# Altium schematic sheet IMX291.SchDoc
size C
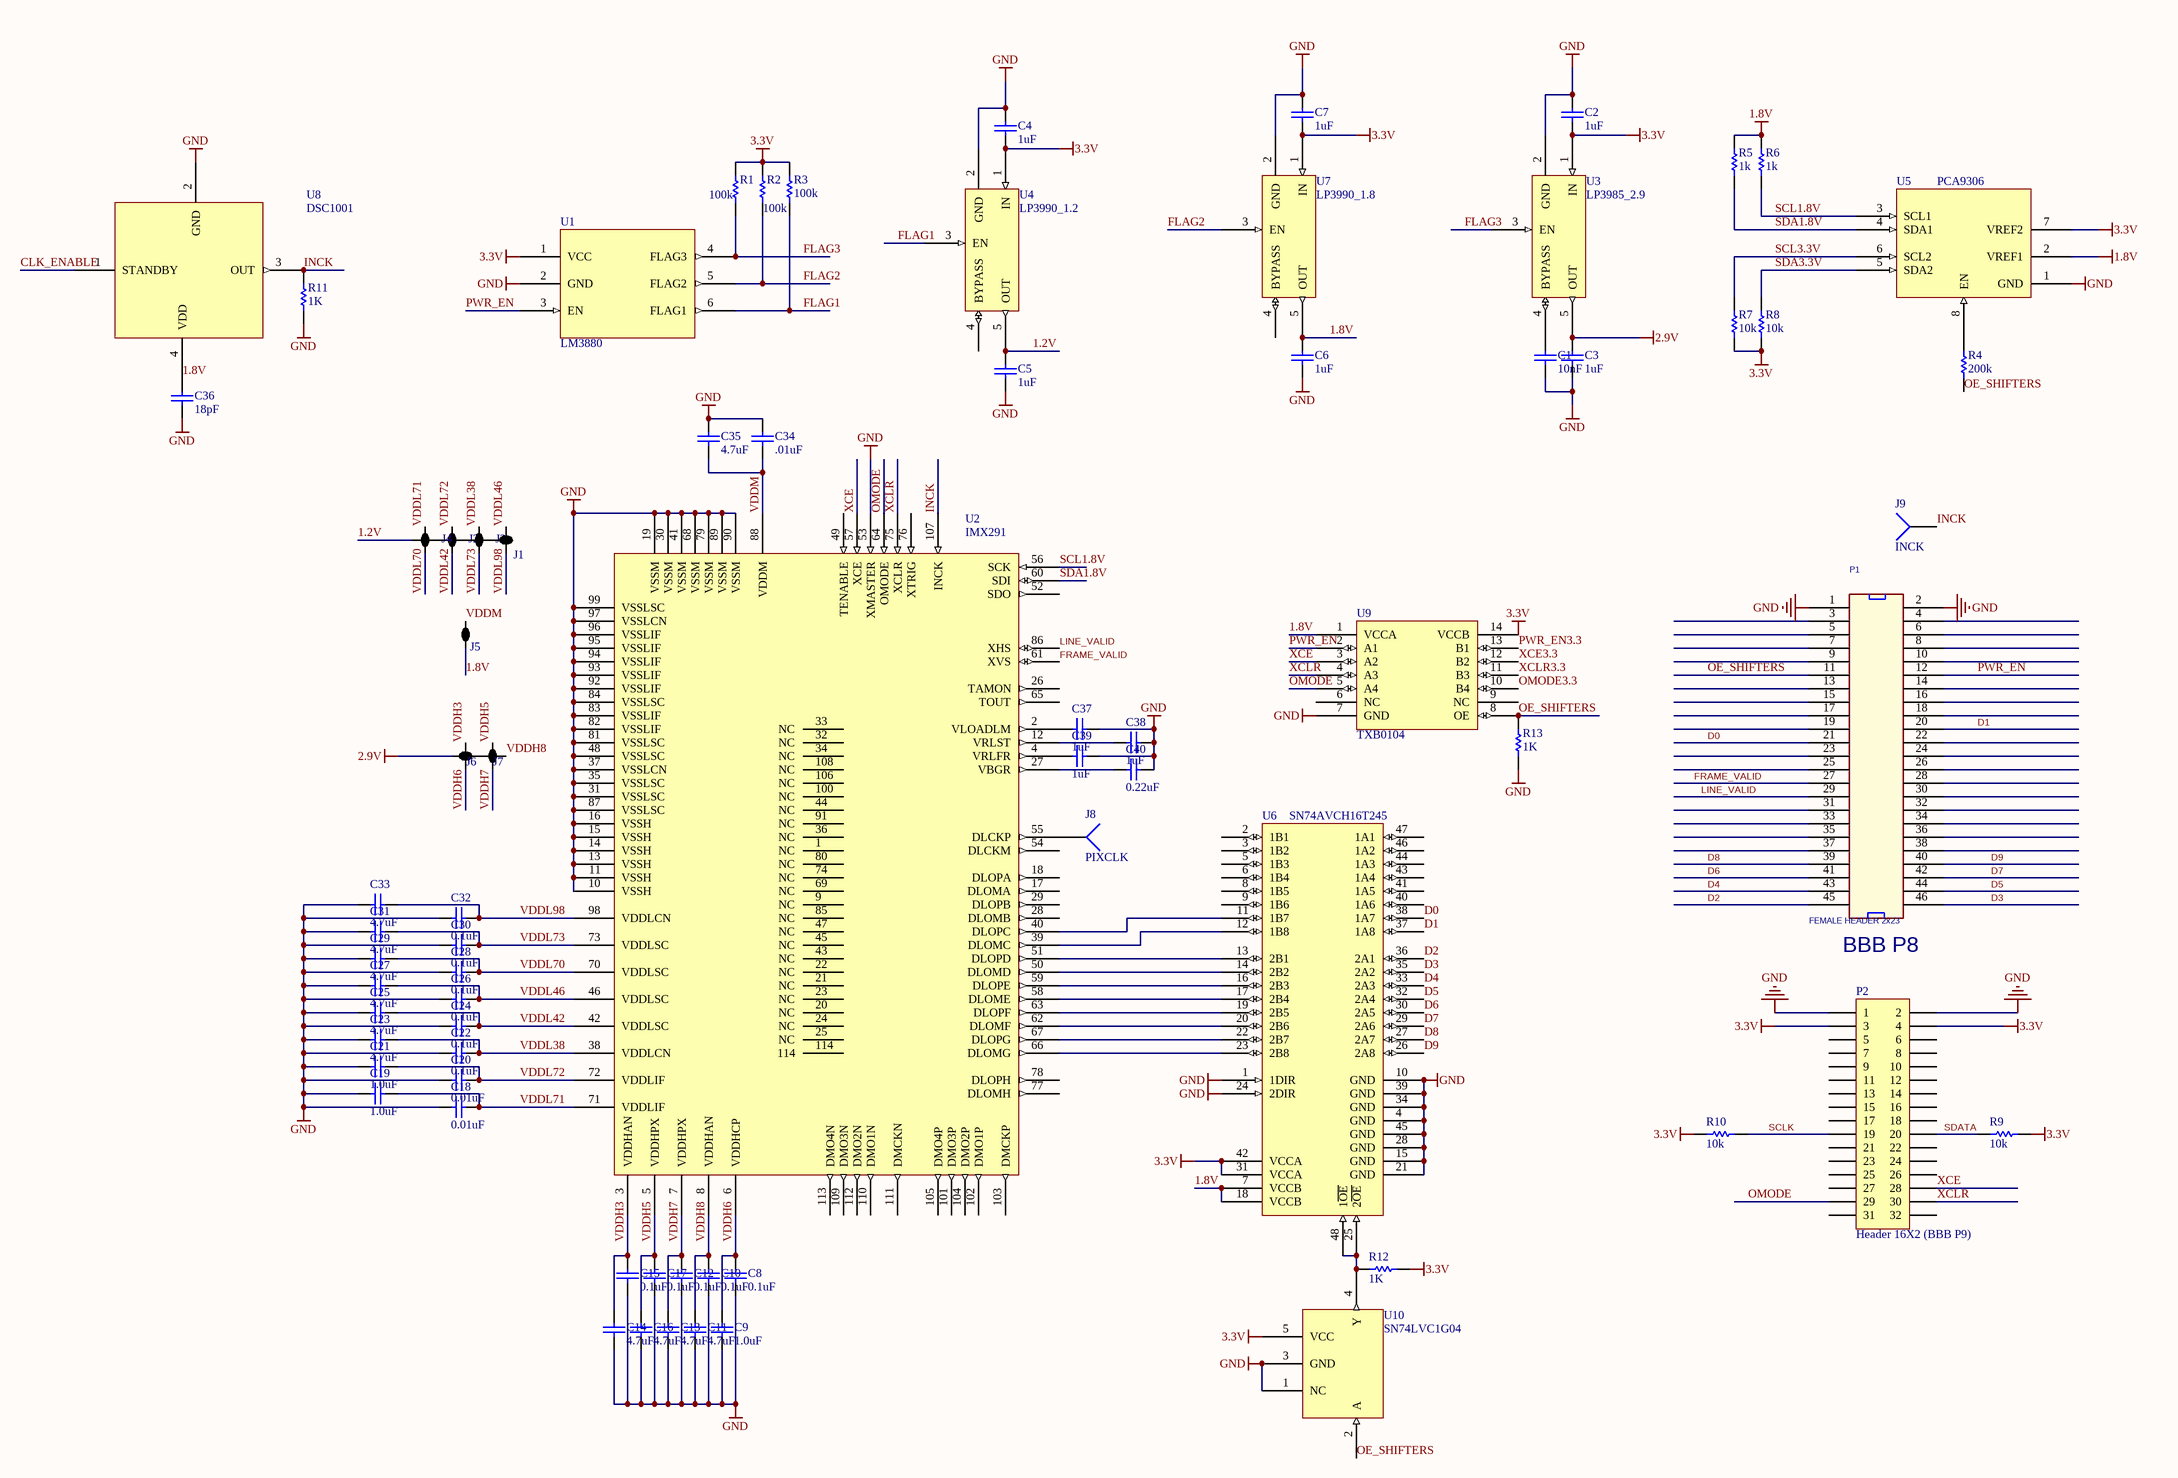
[diagram p0: IMX291.SchDoc]

## Parts
C1  10nF  [0603]
C2  1uF  [0603]
C3  1uF  [0603]
C4  1uF  [0603]
C5  1uF  [0603]
C6  1uF  [0603]
C7  1uF  [0603]
C8  0.1uF  [0603]
C9  1.0uF  [0603]
C10  0.1uF  [0603]
C11  4.7uF  [0603]
C12  0.1uF  [0603]
C13  4.7uF  [0603]
C14  4.7uF  [0603]
C15  0.1uF  [0603]
C16  4.7uF  [0603]
C17  0.1uF  [0603]
C18  0.01uF  [0603]
C19  1.0uF  [0603]
C20  0.01uF  [0603]
C21  1.0uF  [0603]
C22  0.1uF  [0603]
C23  4.7uF  [0603]
C24  0.1uF  [0603]
C25  4.7uF  [0603]
C26  0.1uF  [0603]
C27  4.7uF  [0603]
C28  0.1uF  [0603]
C29  4.7uF  [0603]
C30  0.1uF  [0603]
C31  4.7uF  [0603]
C32  0.1uF  [0603]
C33  4.7uF  [0603]
C34  .01uF  [0603]
C35  4.7uF  [0603]
C36  18pF  [0603]
C37  1uF  [0603]
C38  1uF  [0603]
C39  1uF  [0603]
C40  0.22uF  [0603]
J1  3 way net tie junction T shape  [3wayT_LP]  (value not drawn)  (net tie, no BOM)
J2  4 way net tie junction  [4way_LP]  (value not drawn)  (net tie, no BOM)
J3  4 way net tie junction  [4way_LP]  (value not drawn)  (net tie, no BOM)
J4  4 way net tie junction  [4way_LP]  (value not drawn)  (net tie, no BOM)
J5  2 way net tie junction  [2way_LP]  (value not drawn)  (net tie, no BOM)
J6  4 way net tie junction  [4way_LP]  (value not drawn)  (net tie, no BOM)
J7  4 way net tie junction  [4way_LP]  (value not drawn)  (net tie, no BOM)
J8  PIXCLK  [PIN1]
J9  INCK  [PIN1]
P1  FEMALE HEADER 2x23  [HEADER23X2]
P2  Header 16X2 (BBB P9)  [HDR2X16]
R1  100k  [0603]
R2  100k  [0603]
R3  100k  [0603]
R4  200k  [0603]
R5  1k  [0603]
R6  1k  [0603]
R7  10k  [0603]
R8  10k  [0603]
R9  10k  [0603]
R10  10k  [0603]
R11  1K  [0603]
R12  1K  [0603]
R13  1K  [0603]
U1  LM3880  [SOT23-6_M]
U2  IMX291  [LGA110C80P14X11_1200X930X350]
U3  LP3985_2.9  [DBV005]
U4  LP3990_1.2  [DBV005]
U5  PCA9306  [D008_M]
U6  SN74AVCH16T245  [TSSOP48]
U7  LP3990_1.8  [DBV005]
U8  DSC1001  [DSC1001]
U9  TXB0104  [TSSOP14_M]
U10  SN74LVC1G04  [DBV005]

## Nets
1.8V: C6.2 C36.2 J5.1 R5.2 R6.2 U5.2(VREF1) U6.7(VCCB) U6.18(VCCB) U7.5(OUT) U8.4(VDD) U9.1(VCCA)
2.9V: C3.2 J6.1 U3.5(OUT)
3.3V: C2.1 C4.1 C7.1 P2.3 P2.4 R1.2 R2.2 R3.2 R7.1 R8.1 R9.2 R10.1 R12.2 U1.1(VCC) U3.1(IN) U4.1(IN) U5.7(VREF2) U6.31(VCCA) U6.42(VCCA) U7.1(IN) U9.14(VCCB) U10.5(VCC)
GND: C1.1 C2.2 C3.1 C4.2 C5.1 C6.1 C7.2 C8.2 C9.2 C10.1 C11.1 C12.1 C13.1 C14.1 C15.1 C16.1 C17.1 C18.1 C19.1 C20.1 C21.1 C22.1 C23.1 C24.1 C25.1 C26.1 C27.1 C28.1 C29.1 C30.1 C31.1 C32.1 C33.1 C34.2 C35.2 C36.1 C37.2 C38.2 C39.2 C40.2 P1.1 P1.2 P2.1 P2.2 R11.1 R13.1 U1.2(GND) U2.10(VSSH) U2.11(VSSH) U2.13(VSSH) U2.14(VSSH) U2.15(VSSH) U2.16(VSSH) U2.19(VSSM) U2.30(VSSM) U2.31(VSSLSC) U2.35(VSSLSC) U2.37(VSSLCN) U2.41(VSSM) U2.48(VSSLSC) U2.53(XMASTER) U2.68(VSSM) U2.79(VSSM) U2.81(VSSLSC) U2.82(VSSLIF) U2.83(VSSLIF) U2.84(VSSLSC) U2.87(VSSLSC) U2.89(VSSM) U2.90(VSSM) U2.92(VSSLIF) U2.93(VSSLIF) U2.94(VSSLIF) U2.95(VSSLIF) U2.96(VSSLIF) U2.97(VSSLCN) U2.99(VSSLSC) U3.2(GND) U4.2(GND) U5.1(GND) U6.1(1DIR) U6.4(GND) U6.10(GND) U6.15(GND) U6.21(GND) U6.24(2DIR) U6.28(GND) U6.34(GND) U6.39(GND) U6.45(GND) U7.2(GND) U8.2(GND) U9.7(GND) U10.1(NC) U10.3(GND)
1.2V: C5.2 J4.3 U4.5(OUT)
CLK_ENABLE: U8.1(STANDBY)
D0: P1.21 U6.38(1A7)
D1: P1.20 U6.37(1A8)
D2: P1.45 U6.36(2A1)
D3: P1.46 U6.35(2A2)
D4: P1.43 U6.33(2A3)
D5: P1.44 U6.32(2A4)
D6: P1.41 U6.30(2A5)
D7: P1.42 U6.29(2A6)
D8: P1.39 U6.27(2A7)
D9: P1.40 U6.26(2A8)
FLAG1: R3.1 U1.6(FLAG1) U4.3(EN)
FLAG2: R2.1 U1.5(FLAG2) U7.3(EN)
FLAG3: R1.1 U1.4(FLAG3) U3.3(EN)
FRAME_VALID: P1.27 U2.61(XVS)
INCK: J9.1 R11.2 U2.107(INCK) U8.3(OUT)
LINE_VALID: P1.29 U2.86(XHS)
OE_SHIFTERS: P1.11 R4.1 R13.2 U9.8(OE) U10.2(A)
OMODE: P2.29 U2.64(OMODE) U9.5(A4)
OMODE3.3: U9.10(B4)
PWR_EN: P1.12 U1.3(EN) U9.2(A1)
PWR_EN3.3: U9.13(B1)
SCL1.8V: R6.1 U2.56(SCK) U5.3(SCL1)
SCL3.3V: R7.2 U5.6(SCL2)
SCLK: P2.19 R10.2
SDA1.8V: R5.1 U2.60(SDI) U5.4(SDA1)
SDA3.3V: R8.2 U5.5(SDA2)
SDATA: P2.20 R9.1
VDDH3: C14.2 C15.2 J6.2 U2.3(VDDHAN)
VDDH5: C16.2 C17.2 J7.1 U2.5(VDDHPX)
VDDH6: C8.1 C9.1 J6.3 U2.6(VDDHCP)
VDDH7: C12.2 C13.2 J7.4 U2.7(VDDHPX)
VDDH8: C10.2 C11.2 J7.2 U2.8(VDDHAN)
VDDL38: C22.2 C23.2 J3.1 U2.38(VDDLCN)
VDDL42: C24.2 C25.2 J2.4 U2.42(VDDLSC)
VDDL46: C26.2 C27.2 J1.2 U2.46(VDDLSC)
VDDL70: C28.2 C29.2 J4.4 U2.70(VDDLSC)
VDDL71: C18.2 C19.2 J4.1 U2.71(VDDLIF)
VDDL72: C20.2 C21.2 J2.1 U2.72(VDDLIF)
VDDL73: C30.2 C31.2 J3.4 U2.73(VDDLSC)
VDDL98: C32.2 C33.2 J1.3 U2.98(VDDLCN)
VDDM: C34.1 C35.1 J5.2 U2.88(VDDM)
XCE: P2.28 U2.57(XCE) U9.3(A2)
XCE3.3: U9.12(B2)
XCLR: P2.30 U2.75(XCLR) U9.4(A3)
XCLR3.3: U9.11(B3)
NetC1_2: C1.2 U3.4(BYPASS)
NetC37_1: C37.1 U2.2(VLOADLM)
NetC38_1: C38.1 U2.12(VRLST)
NetC39_1: C39.1 U2.4(VRLFR)
NetC40_1: C40.1 U2.27(VBGR)
NetJ1_1: J1.1 J3.2
NetJ2_2: J2.2 J3.3
NetJ2_3: J2.3 J4.2
NetJ6_4: J6.4 J7.3
NetJ8_1: J8.1 U2.55(DLCKP)
NetR4_2: R4.2 U5.8(EN)
NetR12_1: R12.1 U6.25(2~{OE}) U6.48(1~{OE}) U10.4(Y)
NetU2_39: U2.39(DLOMC) U6.12(1B8)
NetU2_40: U2.40(DLOPC) U6.11(1B7)
NetU2_50: U2.50(DLOMD) U6.14(2B2)
NetU2_51: U2.51(DLOPD) U6.13(2B1)
NetU2_58: U2.58(DLOME) U6.17(2B4)
NetU2_59: U2.59(DLOPE) U6.16(2B3)
NetU2_62: U2.62(DLOMF) U6.20(2B6)
NetU2_63: U2.63(DLOPF) U6.19(2B5)
NetU2_66: U2.66(DLOMG) U6.23(2B8)
NetU2_67: U2.67(DLOPG) U6.22(2B7)

Not connected (* = marked no-connect by the designer): P1 3(2) 4(27) 5(3) 6(28) 7(4) 8(29) 9(5) 10(30) 13(7) 14(32) 15(8) 16(33) 17(9) 18(34) 19(10) 22(36) 23(12) 24(37) 25(13) 26(38) 28(39) 30(40) 31(16) 32(41) 33(17) 34(42) 35(18) 36(43) 37(19) 38(44); P2 5 6 7 8 9 10 11 12 13 14 15 16 17 18 21 22 23 24 25 26 27 31 32; U2 1(NC) 9(NC) 17(DLOMA) 18(DLOPA) 20(NC) 21(NC) 22(NC) 23(NC) 24(NC) 25(NC) 26(TAMON) 28(DLOMB) 29(DLOPB) 32(NC) 33(NC) 34(NC) 36(NC) 43(NC) 44(NC) 45(NC) 47(NC) 49(TENABLE) 52(SDO) 54(DLCKM) 65(TOUT) 69(NC) 74(NC) 76(XTRIG) 77(DLOMH) 78(DLOPH) 80(NC) 85(NC) 91(NC) 100(NC) 101(DMO3P) 102(DMO1P) 103(DMCKP) 104(DMO2P) 105(DMO4P) 106(NC) 108(NC) 109(DMO3N) 110(DMO1N) 111(DMCKN) 112(DMO2N) 113(DMO4N) 114; U4 4(BYPASS); U6 2(1B1) 3(1B2) 5(1B3) 6(1B4) 8(1B5) 9(1B6) 40(1A6) 41(1A5) 43(1A4) 44(1A3) 46(1A2) 47(1A1); U7 4(BYPASS); U9 6(NC) 9(NC)

## Notes on the sheet
- (near P1) BBB P8

## Library data of the parts
C1-C40 = cap
J1 = 3wayT: Note: 2 display modes available; ComponentLink1URL: http://www.edatools.cz/addons; ComponentLink1Description: Source; FootprintNote: LP=12mil, MP=40mil, HP=120mil
J2-J4 J6 J7 = 4way: Note: 2 display modes available; ComponentLink1URL: http://www.edatools.cz/addons; ComponentLink1Description: Source; FootprintNote: LP=12mil, MP=40mil, HP=120mil
J5 = 2way: ComponentLink1URL: http://www.edatools.cz/addons; ComponentLink1Description: Source; FootprintNote: LP=12mil, MP=40mil, HP=120mil
J8 J9 = Socket: LatestRevisionDate: 17-Jul-2002; LatestRevisionNote: Re-released for DXP Platform.; Publisher: Altium Limited
P1 = HDR_46_F_2_0.1_0.1: CONN HEADER FMAL 46PS.1" DL GOLD; Manufacturer: Sullins Connector Solutions; Manufacturer Part Number: PPPC232LFBN-RC; Number of Positions: 46; Number of Positions Loaded: All; Pitch: 0.100" (2.54mm); Supplier 1: Digi-Key; Supplier Part Number 1: S7126-ND; RoHS: RoHS Compliant; Category: Connectors, Interconnects; Stock 1: 750; Pricing 1: 1=2.75, 10=2.325, 25=2.2196, 50=2.0084, 100=1.7969, 250=1.58552, 500=1.4798, 1000=1.3741, 2500=1.32125 (USD); Connector Type: Header; Contact Type: Female Socket; Number of Rows: 2; Row Spacing: 0.100" (2.54mm); Mounting Type: Through Hole; Termination: Solder; Fastening Type: -; Features: -; Contact Finish: Gold; Contact Finish Thickness: Flash; Color: Black; Packaging: Bulk; ComponentLink1URL: http://www.sullinscorp.com/drawings/78_P(N)PxCxxxLFBN-RC,_10492-G.pdf; ComponentLink1Description: http://www.sullinscorp.com/drawings/78_P(N)PxCxxxLFBN-RC,_10492-G.pdf
P2 = Header 16X2: Header, 16-Pin, Dual row; LatestRevisionDate: 17-Jul-2002; LatestRevisionNote: Re-released for DXP Platform.; Publisher: Altium Limited
R1-R10 = Res: resistor
R11-R13 = res
U3 = LP3985
U4 U7 = LP3990